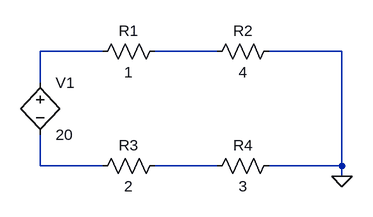
[diagram p0: schematic LtSpiceTest.asc]
LtSpiceTest.asc, the LTspice schematic file:
Version 4
SHEET 1 880 680
WIRE 64 96 -32 96
WIRE 240 96 144 96
WIRE 432 96 320 96
WIRE -32 144 -32 96
WIRE -32 272 -32 224
WIRE 64 272 -32 272
WIRE 240 272 144 272
WIRE 432 272 432 96
WIRE 432 272 320 272
WIRE 432 288 432 272
FLAG 432 288 0
SYMBOL res 48 112 R270
WINDOW 0 32 56 VTop 2
WINDOW 3 0 56 VBottom 2
SYMATTR InstName R1
SYMATTR Value 1
SYMBOL res 224 112 R270
WINDOW 0 32 56 VTop 2
WINDOW 3 0 56 VBottom 2
SYMATTR InstName R2
SYMATTR Value 4
SYMBOL res 48 288 R270
WINDOW 0 32 56 VTop 2
WINDOW 3 0 56 VBottom 2
SYMATTR InstName R3
SYMATTR Value 2
SYMBOL res 224 288 R270
WINDOW 0 32 56 VTop 2
WINDOW 3 0 56 VBottom 2
SYMATTR InstName R4
SYMATTR Value 3
SYMBOL bv -32 128 R0
SYMATTR InstName V1
SYMATTR Value 20

The netlist it stands for:
* LtSpiceTest.asc
R1 N001 N002 1
R2 N002 0 4
R3 N003 N004 2
R4 N004 0 3
B§V1 N001 N003 20
.backanno
.end